# Altium schematic sheet Energy_harvesting.SchDoc: Triumvi - Sensing - Energy Harvesting
size Letter; Author: Ye-Sheng Kuo; Revision: 9; SheetNumber: 2; SheetTotal: 6
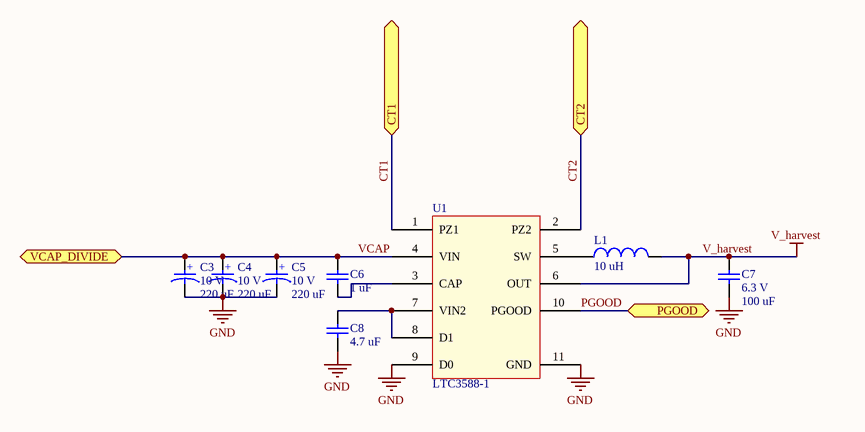
[diagram p0: Energy_harvesting.SchDoc]

## Parts
C3  value 220 uF  voltage rated: 10 V  [2312]  (hidden comment: Tantalum capacitor)
C4  value 220 uF  voltage rated: 10 V  [2312]  (hidden comment: Tantalum capacitor)
C5  value 220 uF  voltage rated: 10 V  [2312]  (hidden comment: Tantalum capacitor)
C6  value 1 uF  [0402]  (hidden comment: Ceramic capacitor)
C7  value 100 uF  voltage rated: 6.3 V  [1206]  (hidden comment: Ceramic capacitor)
C8  value 4.7 uF  [0603]  (hidden comment: Ceramic capacitor)
L1  value 10 uH  [CDRH2D18]  (hidden comment: Chip inductor)
U1  LTC3588-1  [QFN-10]

## Ports
CT1, CT2, PGOOD, VCAP_DIVIDE

## Nets
GND: C3.2 C4.2 C5.2 C7.2 C8.2 U1.9(D0) U1.11(GND)
V_harvest: C7.1 L1.1 U1.6(OUT)
CT1: U1.1(PZ1) ; port CT1
CT2: U1.2(PZ2) ; port CT2
PGOOD: U1.10(PGOOD) ; port PGOOD
VCAP: C3.1 C4.1 C5.1 C6.1 U1.4(VIN) ; port VCAP_DIVIDE
NetC6_2: C6.2 U1.3(CAP)
NetC8_1: C8.1 U1.7(VIN2) U1.8(D1)
NetL1_2: L1.2 U1.5(SW)

## Notes on the sheet
- Title
- Date:
- Author:
- Revision:
- Sheet
- of
- University of Michigan
- File:
- (in symbol C_220u_10V_2312_tantalum) +

## Library data of the parts
C3-C5 = C_220u_10V_2312_tantalum: Tantalum capacitor, 220 uF, 10 V, 2312 package; Manufacture: AVX; tolerance: 10%; package: 1206; Supplier 1: Digi-Key; Supplier Part Number 1: 478-4774-1-ND
C6 = C_1u_16V_0402_ceramic: Ceramic capacitor, 1 uF, 16V, 0402 package; Manufacture: TDK; tolerance: 10%; Temperature rating: X5R; voltage rated: 16 V; package: 0402; Supplier 1: Digi-Key; Supplier Part Number 1: 445-4978-1-ND
C7 = C_100u_6.3V_1206_ceramic: Ceramic capacitor, 100 uF, 6.3 V, 1206 package; Manufacture: Murata; tolerance: 20%; package: 1206; Supplier 1: Digi-Key; Supplier Part Number 1: 490-7217-1-ND
C8 = C_4.7u_10V_0603_ceramic: Ceramic capacitor, 4.7u, 10V, 0603 package; Manufacture: TDK; tolerance: 20%; Temp rating: X5R; package: 0603; voltage rated: 10 V; Supplier 1: Digi-Key; Supplier Part Number 1: 445-7482-1-ND
L1 = L_10uH_1A_180m: Chip inductor, 10 uH,  1A, 180 mOhm; tolerance: 30%; Supplier 1: Digi-Key; Supplier Part Number 1: 308-1959-1-ND
U1 = LTC3588-1: Piezoelectric Energy   Harvesting Power Supply; Supplier 1: Digi-Key; Supplier Part Number 1: LTC3588EMSE-1#PBF-ND; Supplier 2: Digi-Key; Supplier Part Number 2: LTC3588EDD-1#PBF-ND